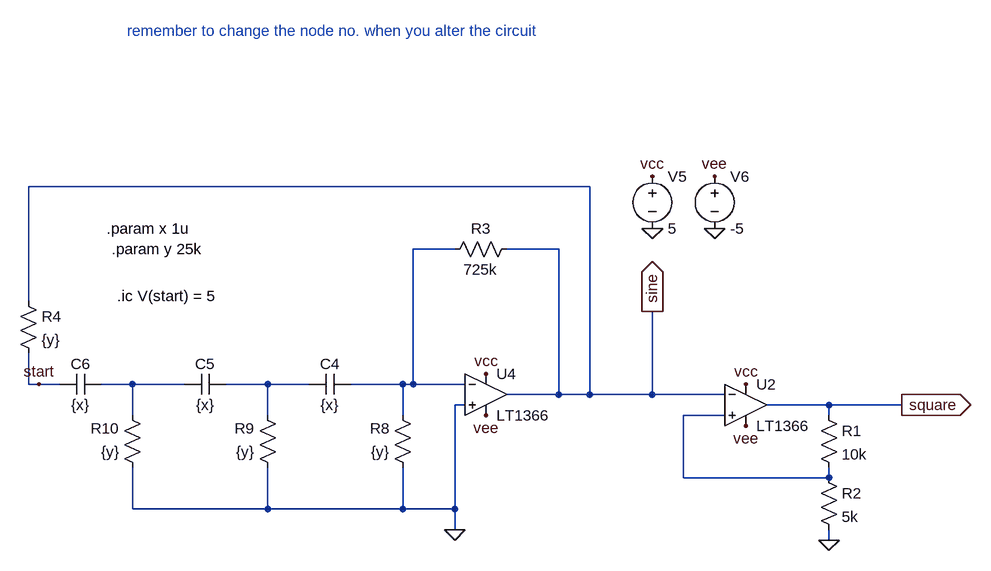
[diagram p0: schematic lfo_new_square.asc]
lfo_new_square.asc, the LTspice schematic file:
Version 4
SHEET 1 1144 880
WIRE -576 -144 -1440 -144
WIRE -784 -48 -848 -48
WIRE -624 -48 -704 -48
WIRE -1440 32 -1440 -144
WIRE -1440 160 -1440 112
WIRE -1424 160 -1440 160
WIRE -1392 160 -1424 160
WIRE -1280 160 -1328 160
WIRE -1200 160 -1280 160
WIRE -1072 160 -1136 160
WIRE -1008 160 -1072 160
WIRE -864 160 -944 160
WIRE -848 160 -848 -48
WIRE -848 160 -864 160
WIRE -768 160 -848 160
WIRE -624 176 -624 -48
WIRE -624 176 -704 176
WIRE -576 176 -576 -144
WIRE -576 176 -624 176
WIRE -480 176 -480 48
WIRE -480 176 -576 176
WIRE -368 176 -480 176
WIRE -768 192 -784 192
WIRE -208 192 -304 192
WIRE -96 192 -208 192
WIRE -1280 208 -1280 160
WIRE -1072 208 -1072 160
WIRE -864 208 -864 160
WIRE -368 208 -432 208
WIRE -208 208 -208 192
WIRE -432 304 -432 208
WIRE -208 304 -208 288
WIRE -208 304 -432 304
WIRE -1280 352 -1280 288
WIRE -1072 352 -1072 288
WIRE -1072 352 -1280 352
WIRE -864 352 -864 288
WIRE -864 352 -1072 352
WIRE -784 352 -784 192
WIRE -784 352 -864 352
WIRE -784 384 -784 352
WIRE -208 400 -208 384
FLAG -208 400 0
FLAG -784 384 0
FLAG -384 -80 0
FLAG -480 -80 0
FLAG -480 -160 vcc
FLAG -384 -160 vee
FLAG -736 144 vcc
FLAG -736 208 vee
FLAG -336 160 vcc
FLAG -336 224 vee
FLAG -96 192 square
IOPIN -96 192 Out
FLAG -480 48 sine
IOPIN -480 48 Out
FLAG -1424 160 start
SYMBOL res -224 192 R0
SYMATTR InstName R1
SYMATTR Value 10k
SYMBOL res -224 288 R0
SYMATTR InstName R2
SYMATTR Value 5k
SYMBOL cap -944 144 R90
WINDOW 0 0 32 VBottom 2
WINDOW 3 32 32 VTop 2
SYMATTR InstName C4
SYMATTR Value {x}
SYMBOL cap -1136 144 R90
WINDOW 0 0 32 VBottom 2
WINDOW 3 32 32 VTop 2
SYMATTR InstName C5
SYMATTR Value {x}
SYMBOL cap -1328 144 R90
WINDOW 0 0 32 VBottom 2
WINDOW 3 32 32 VTop 2
SYMATTR InstName C6
SYMATTR Value {x}
SYMBOL res -848 304 R180
WINDOW 0 36 76 Left 2
WINDOW 3 36 40 Left 2
SYMATTR InstName R8
SYMATTR Value {y}
SYMBOL res -1056 304 R180
WINDOW 0 36 76 Left 2
WINDOW 3 36 40 Left 2
SYMATTR InstName R9
SYMATTR Value {y}
SYMBOL res -1264 304 R180
WINDOW 0 36 76 Left 2
WINDOW 3 36 40 Left 2
SYMATTR InstName R10
SYMATTR Value {y}
SYMBOL Opamps/LT1366 -736 112 R0
SYMATTR InstName U4
SYMBOL voltage -480 -176 R0
SYMATTR InstName V5
SYMATTR Value 5
SYMBOL voltage -384 -176 R0
SYMATTR InstName V6
SYMATTR Value -5
SYMBOL Opamps/LT1366 -336 128 R0
SYMATTR InstName U2
SYMBOL res -688 -64 R90
WINDOW 0 0 56 VBottom 2
WINDOW 3 32 56 VTop 2
SYMATTR InstName R3
SYMATTR Value 725k
SYMBOL res -1456 16 R0
SYMATTR InstName R4
SYMATTR Value {y}
TEXT -1320 -80 Left 2 !.param x 1u
TEXT -1312 -48 Left 2 !.param y 25k
TEXT -1288 -384 Left 2 ;remember to change the node no. when you alter the circuit
TEXT -1304 24 Left 2 !.ic V(start) = 5

The netlist it stands for:
* lfo_new_square.asc
R1 square N004 10k
R2 N004 0 5k
C4 N001 N003 {x}
C5 N003 N002 {x}
C6 N002 start {x}
R8 0 N001 {y}
R9 0 N003 {y}
R10 0 N002 {y}
XU4 0 N001 vcc vee sine LT1366  ; pins In+ In- V+ V- OUT
V5 vcc 0 5
V6 vee 0 -5
XU2 N004 sine vcc vee square LT1366  ; pins In+ In- V+ V- OUT
R3 sine N001 725k
R4 sine start {y}
.param x 1u
.param y 25k
* remember to change the node no. when you alter the circuit
.ic V(start) = 5
.lib LTC.lib
.backanno
.end